# Altium schematic sheet UnidirectionalLevelShifiting.SchDoc
size A4; CompanyName: Technische Hochschule Nürnberg Georg Simon Ohm; Address1: Fürther Straße 250; Address2: 90429 Nürnberg; Address3: GERMANY; CompanyName2: Institut ELSYS
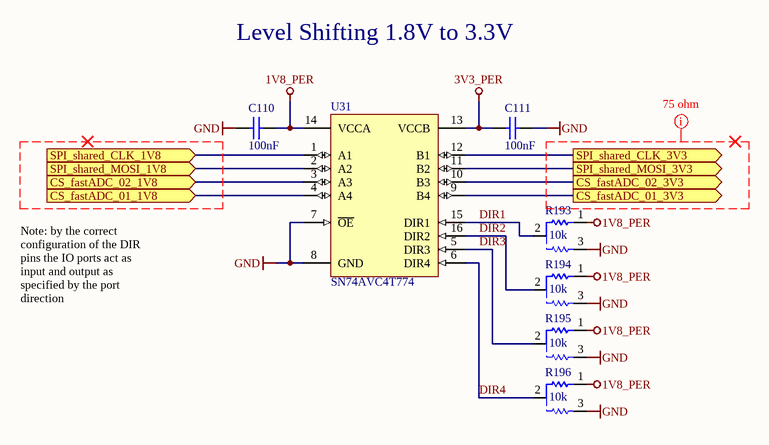
[diagram p0: UnidirectionalLevelShifiting.SchDoc]

## Parts
C110  100nF  [C_0603(1608)100_L]
C111  100nF  [C_0603(1608)100_L]
R193  10k  [0603_Config]
R194  10k  [0603_Config]
R195  10k  [0603_Config]
R196  10k  [0603_Config]
U31  SN74AVC4T774  [QFN40P260X180X55-16N]

## Ports
CS_fastADC_01_1V8 (in), CS_fastADC_01_3V3 (out), CS_fastADC_02_1V8 (in), CS_fastADC_02_3V3 (out), SPI_shared_CLK_1V8 (in), SPI_shared_CLK_3V3 (out), SPI_shared_MOSI_1V8 (in), SPI_shared_MOSI_3V3 (out)

## Nets
1V8_PER: C110.1 R193.1 R194.1 R195.1 R196.1 U31.14(VCCA)
3V3_PER: C111.2 U31.13(VCCB)
GND: C110.2 C111.1 R193.3 R194.3 R195.3 R196.3 U31.7(~{OE}) U31.8(GND)
CS_fastADC_01_1V8: U31.4(A4) ; port CS_fastADC_01_1V8
CS_fastADC_01_3V3: U31.9(B4) ; port CS_fastADC_01_3V3
CS_fastADC_02_1V8: U31.3(A3) ; port CS_fastADC_02_1V8
CS_fastADC_02_3V3: U31.10(B3) ; port CS_fastADC_02_3V3
DIR1: R193.2 U31.15(DIR1)
DIR2: R194.2 U31.16(DIR2)
DIR3: R195.2 U31.5(DIR3)
DIR4: R196.2 U31.6(DIR4)
SPI_shared_CLK_1V8: U31.1(A1) ; port SPI_shared_CLK_1V8
SPI_shared_CLK_3V3: U31.12(B1) ; port SPI_shared_CLK_3V3
SPI_shared_MOSI_1V8: U31.2(A2) ; port SPI_shared_MOSI_1V8
SPI_shared_MOSI_3V3: U31.11(B2) ; port SPI_shared_MOSI_3V3

## Layout directives
net class S75: (no net found under the mark)

## Notes on the sheet
- Level Shifting 1.8V to 3.3V
- Note: by the correct configuration of the DIR pins the IO ports act as input and output as specified by the port direction
- Title
- Size:
- Date:
- A4
- Revision:
- Time:
- Sheet
- of
- Author:
- Project:

## Library data of the parts
C110 C111 = C_0603: Capacitor 0603; MPN: MC0603B104K500CT; Tolerance: ±10%; Voltage: 50V; MF: Multicomp; Dielectric: X7R; Value: 100nF; Package: 0603; Created: 2018_09_13_AGeiger; Supplier Part Number 1: 1759122; Supplier 1: Farnell
R193-R196 = R_config: Solder 0603 resistor/jumper between pads 1 and 2 for standard function. Solter resistor between pads 2 and 3 for alternative function; MPN: MCWR06X1002FTL; MF: Multicomp; Voltage: 50V; Power: 100mW; Tolerance: 1%; Created: 2018_09_04_AGeiger; Value: 10k; Package: 0603; Supplier Part Number 1: 2447230; Supplier 1: Farnell
U31 = SN74AVC4T774RSVR: 4-Bit Dual-Supply Bus Transceiver With Configurable Voltage-Level Shifting and 3-State Outputs With Independent Direction Control Inputs; MF: Texas Instruments; Package: UQFN-16; HelpURL: http://www.ti.com/product/SN74AVC4T774; MPN: SN74AVC4T774RSVR; Value: SN74AVC4T774; Created: 2018_09_13_AGeiger; Supplier Part Number 1: 595-SN74AVC4T774RSVR; Supplier 1: Mouser; ComponentLink1Description: Datasheet; ComponentLink1URL: http://www.ti.com/lit/ds/symlink/sn74avc4t774.pdf